# Altium schematic sheet QCopterMV_DCMI_Sch.SchDoc
size A4
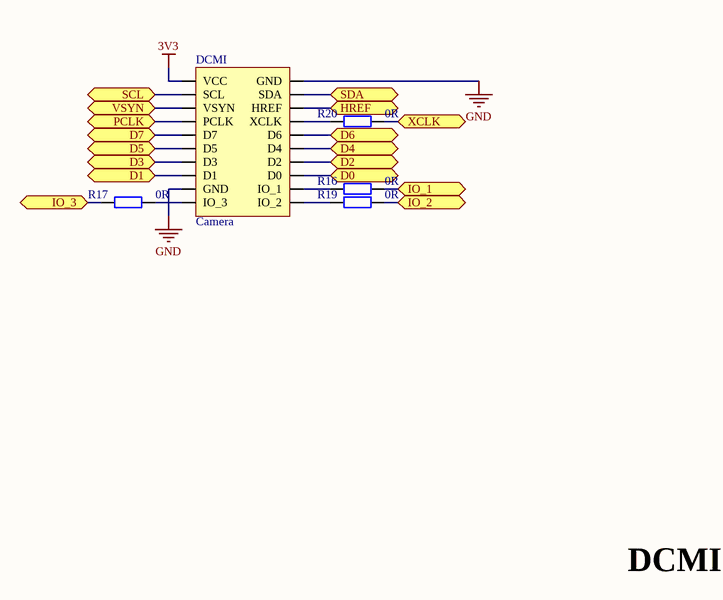
[diagram p0: QCopterMV_DCMI_Sch.SchDoc]

## Parts
DCMI  Camera  [CAMERA]
R16  value 0R  [RES_0603]  (hidden comment: Res_0603)
R17  value 0R  [RES_0603]  (hidden comment: Res_0603)
R19  value 0R  [RES_0603]  (hidden comment: Res_0603)
R20  value 0R  [RES_0603]  (hidden comment: Res_0603)

## Ports
D0, D1, D2, D3, D4, D5, D6, D7, HREF, IO_1, IO_2, IO_3, PCLK, SCL, SDA, VSYN, XCLK

## Nets
3V3: DCMI.1(VCC)
GND: DCMI.2(GND) DCMI.17(GND)
D0: DCMI.16(D0) ; port D0
D1: DCMI.15(D1) ; port D1
D2: DCMI.14(D2) ; port D2
D3: DCMI.13(D3) ; port D3
D4: DCMI.12(D4) ; port D4
D5: DCMI.11(D5) ; port D5
D6: DCMI.10(D6) ; port D6
D7: DCMI.9(D7) ; port D7
HREF: DCMI.6(HREF) ; port HREF
IO_1: R16.2 ; port IO_1
IO_2: R19.2 ; port IO_2
IO_3: R17.1 ; port IO_3
PCLK: DCMI.7(PCLK) ; port PCLK
SCL: DCMI.3(SCL) ; port SCL
SDA: DCMI.4(SDA) ; port SDA
VSYN: DCMI.5(VSYN) ; port VSYN
XCLK: R20.2 ; port XCLK
NetDCMI_8: DCMI.8(XCLK) R20.1
NetDCMI_18: DCMI.18(IO_1) R16.1
NetDCMI_19: DCMI.19(IO_3) R17.2
NetDCMI_20: DCMI.20(IO_2) R19.1

## Notes on the sheet
- DCMI

## Library data of the parts
DCMI = Camera: Module
R16 R17 R19 R20 = Res_0603: Resistor